# EAGLE design AetherMesh Test Fixture Mezz V1.0 (EAGLE 9.0.0)
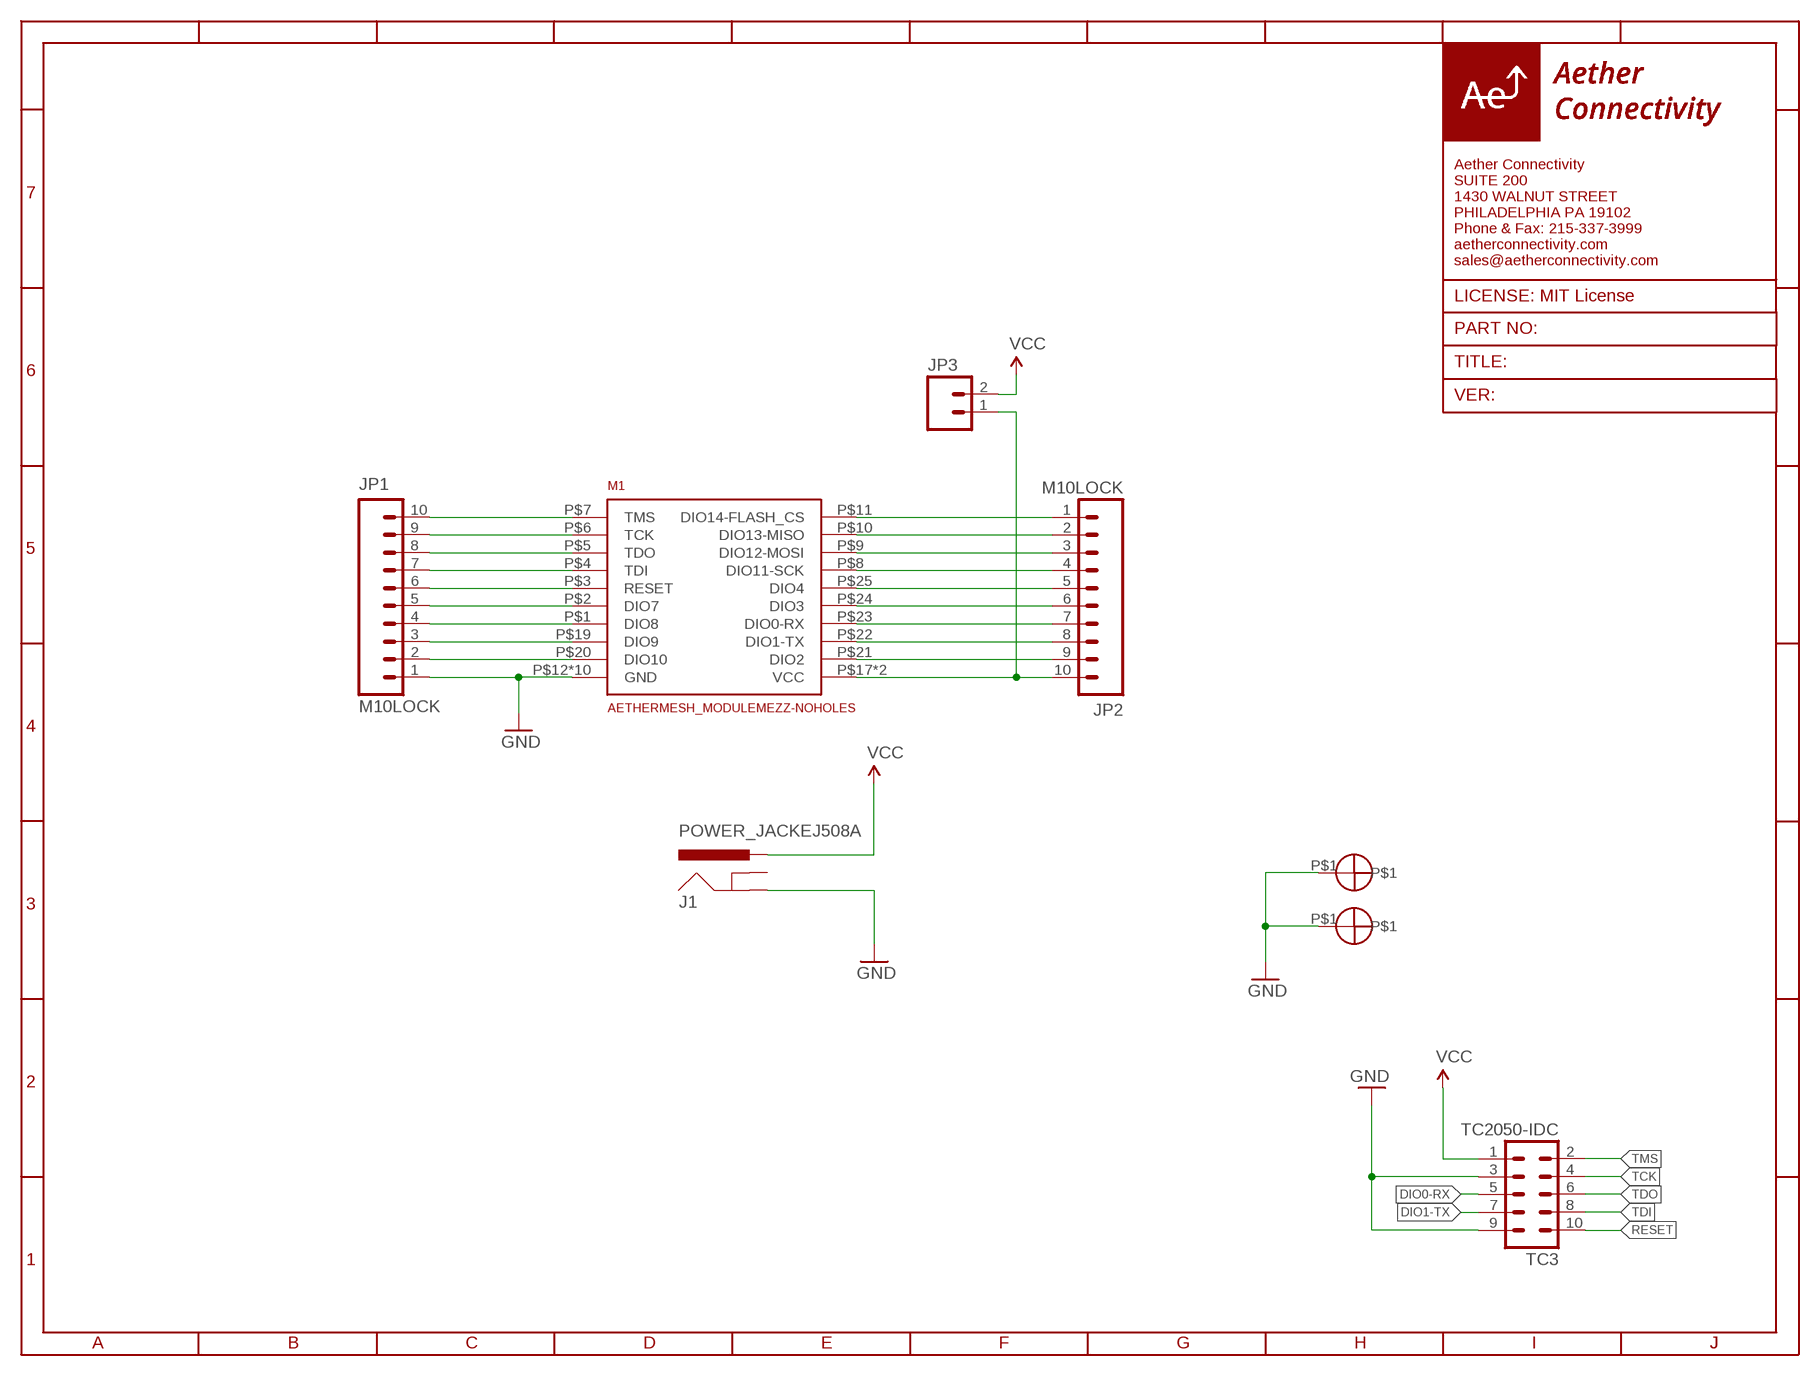
[diagram p0: schematic, sheet 1]

## Parts
J1  POWER_JACKEJ508A  [DC_JACK_EJ508A]
JP1  M10LOCK  [1X10_LOCK]
JP2  M10LOCK  [1X10_LOCK]
JP3  M02LOCK  [1X02_LOCK]
M1  AETHERMESH_MODULEMEZZ-NOHOLES  [AETHERMESH_MEZZ_MOUNT_NOHOLES]
S1  STANDOFFWURTH  [STANDOFF_WURTH_9774040243R]
S2  STANDOFFWURTH  [STANDOFF_WURTH_9774040243R]
TC3  TC2050-IDC  [TC2050-IDC]

## Nets
BUTTON: JP1.2 M1.P$20(DIO10)
CS: JP1.5 M1.P$2(DIO7)
DIO0-RX: JP2.7 M1.P$23(DIO0-RX) TC3.5
DIO1-TX: JP2.8 M1.P$22(DIO1-TX) TC3.7
DIO2: JP2.9 M1.P$21(DIO2)
DIO3: JP2.6 M1.P$24(DIO3)
DIO4: JP2.5 M1.P$25(DIO4)
ENC_RESET: JP1.4 M1.P$1(DIO8)
GND: J1.1(GND) JP1.1 M1.P$12(GND) M1.P$13(GND) M1.P$14(GND) M1.P$15(GND) M1.P$16(GND) M1.P$26(GND) M1.P$27(GND) M1.P$28(GND) M1.P$29(GND) M1.P$30(GND) S1.P$1 S2.P$1 TC3.3 TC3.9
INT: JP1.3 M1.P$19(DIO9)
MISO: JP2.2 M1.P$10(DIO13-MISO)
MOSI: JP2.3 M1.P$9(DIO12-MOSI)
N$1: JP2.1 M1.P$11(DIO14-FLASH_CS)
N$3: JP2.10 JP3.1 M1.P$17(VCC) M1.P$18(VCC)
RESET: JP1.6 M1.P$3(RESET) TC3.10
SCK: JP2.4 M1.P$8(DIO11-SCK)
TCK: JP1.9 M1.P$6(TCK) TC3.4
TDI: JP1.7 M1.P$4(TDI) TC3.8
TDO: JP1.8 M1.P$5(TDO) TC3.6
TMS: JP1.10 M1.P$7(TMS) TC3.2
VCC: J1.3(PWR) JP3.2 TC3.1
Unconnected: J1.2(GNDBREAK)

## Library data of the parts
J1 = 3. growflux:POWER_JACK: Power Jack This is the standard 5.5mm barrel jack for power. The PTH is the most common, proven, reliable, footprint. The Slot footprint only works if the mill layer is transmitted to the PCB fab house so be warned. Mating wall wart : TOL-00298 (and others)
JP1 JP2 = 3. growflux:M10: Header 10 Standard 10-pin 0.1" header. Use with straight break away headers (SKU : PRT-00116), right angle break away headers (PRT-00553), swiss pins (PRT-00743), machine pins (PRT-00117), and female headers (PRT-00115).
JP3 = 1. growflux:M02: Header 2 Standard 2-pin 0.1" header. Use with straight break away headers (SKU : PRT-00116), right angle break away headers (PRT-00553), swiss pins (PRT-00743), machine pins (PRT-00117), and female headers (PRT-00115). Molex polarized connector foot print use with SKU : PRT-08233 with associated crimp pins and housings.
M1 = AetherConnectivity:AETHERMESH_MODULE
S1 S2 = AetherConnectivity:STANDOFF; MFG#: 9774040243R
TC3 = TagConnect:TC2050-IDC: Tag-Connect In Circuit Programming & Debug Cable 10 Pin http://www.tag-connect.com

## Board
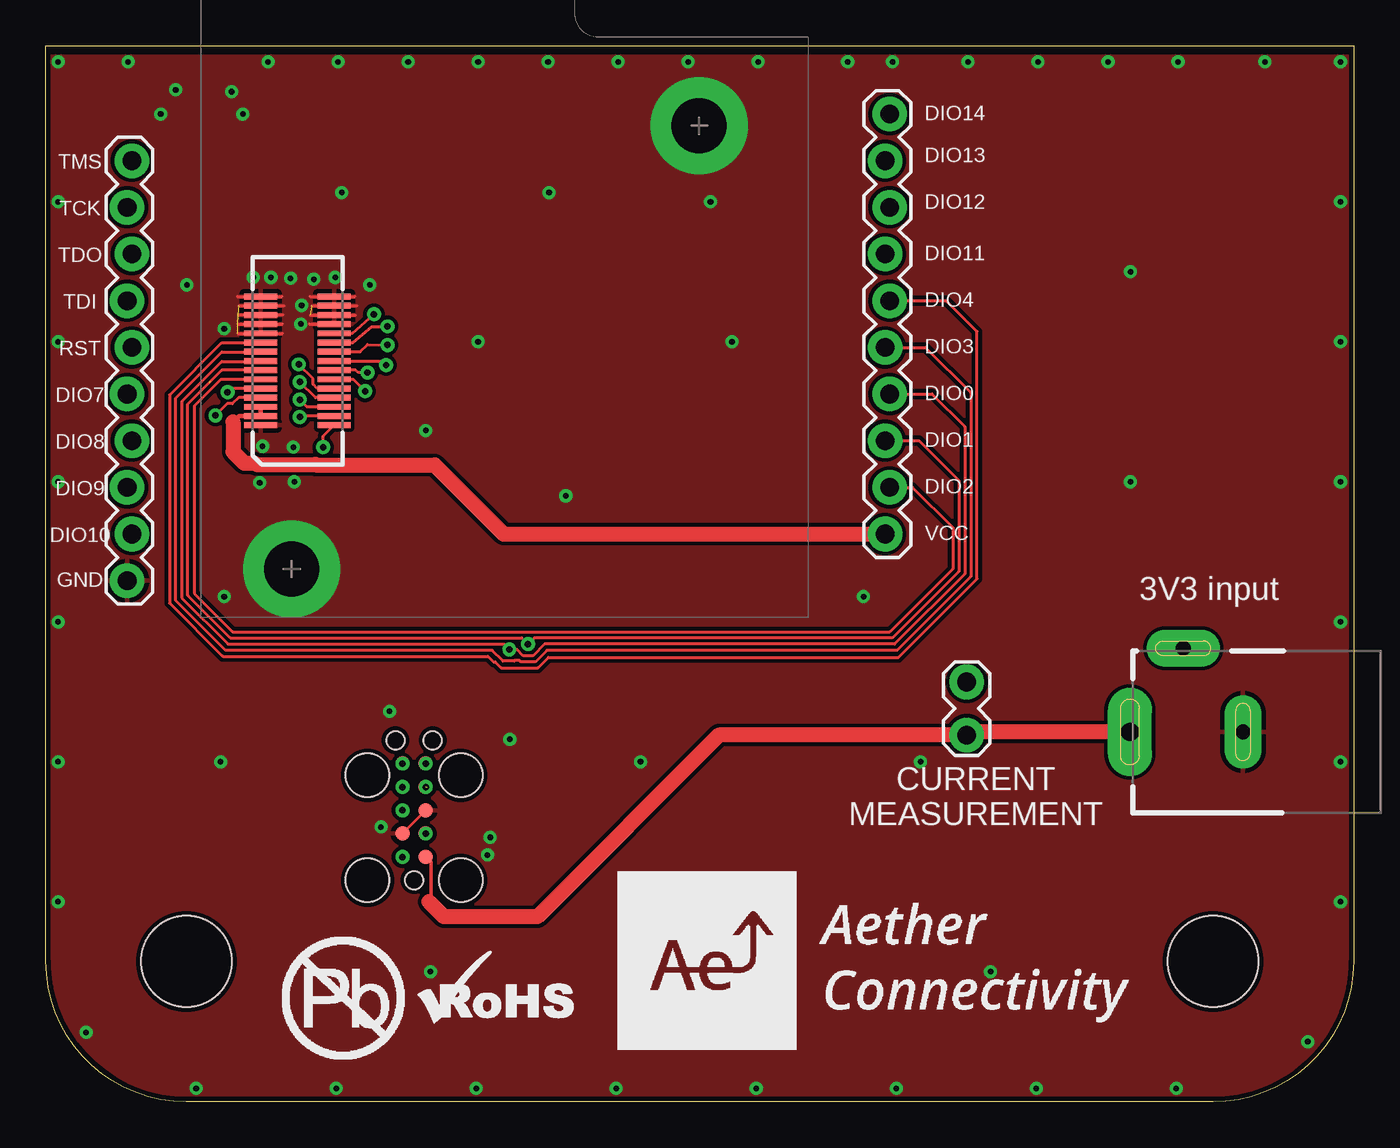
[diagram p1: board, top side]
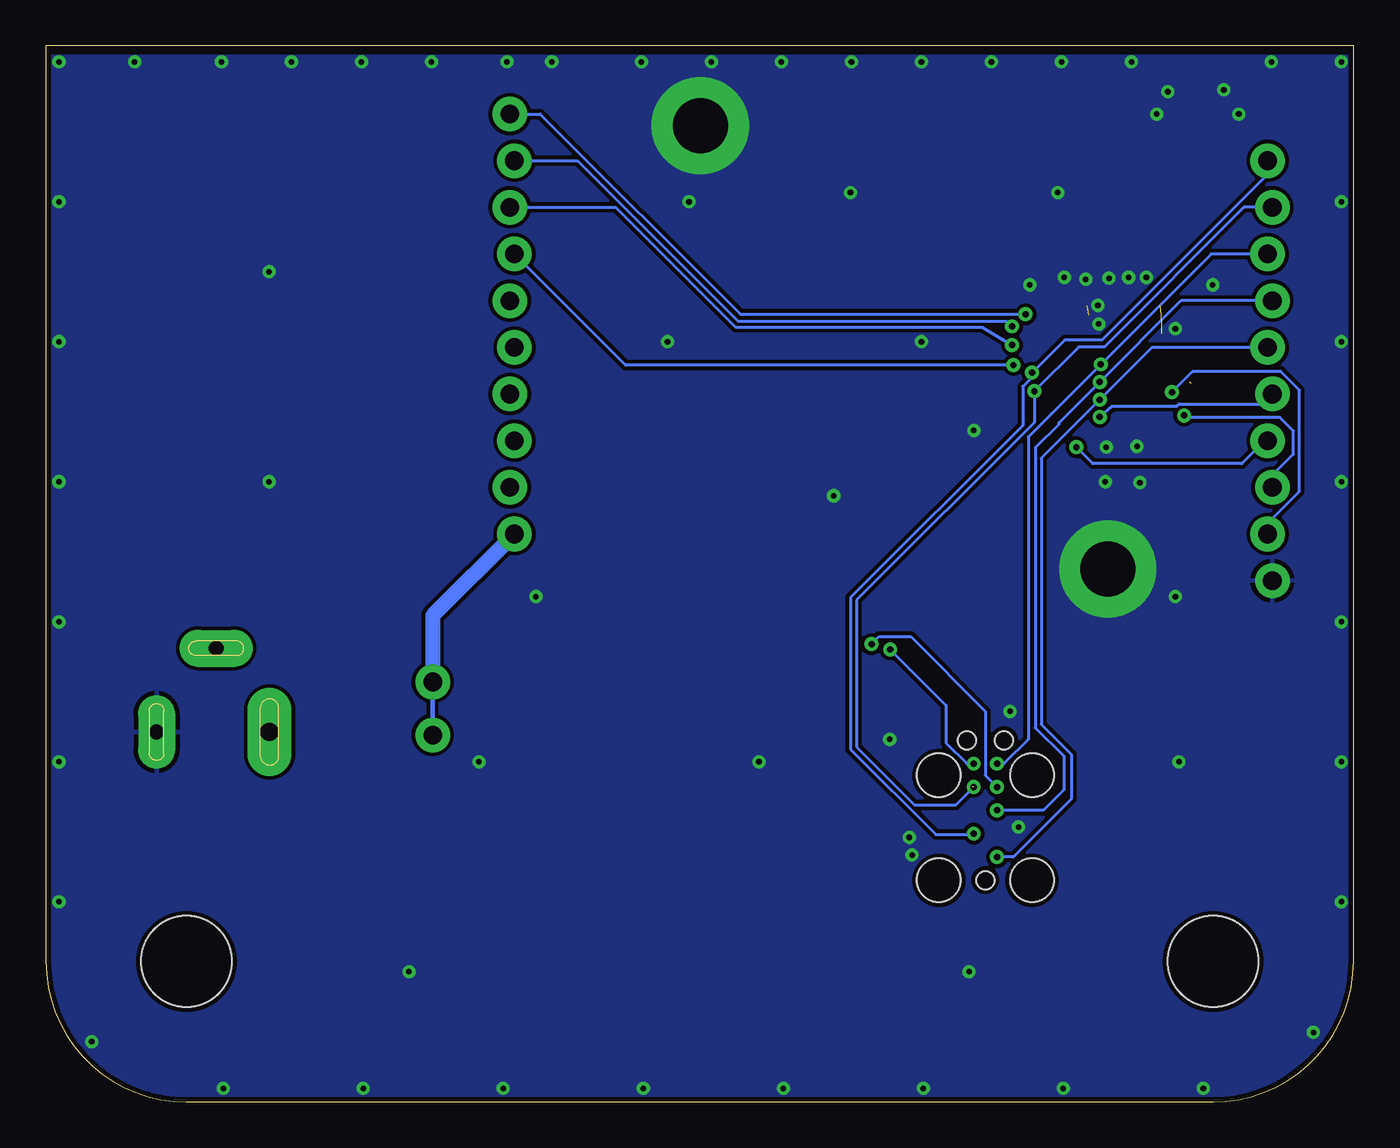
[diagram p2: board, bottom side, seen from below]

Size 71.17 x 57.48 mm. Coordinates in mm from the lower left corner, seen from the top.
Outline: 71.17,7.65 arc-90 63.53,0 7.65,0 arc-90 0,7.65 0,57.48 71.17,57.48 71.17,7.65
Copper layers (1*16): Top 0.035mm / dielectric 1.5mm / Bottom 0.035mm
Design rules "default *": minimum track width 6mil, minimum drill 12mil, track to track 7mil, track to pad 7mil, pad to pad 7mil, via to via 7mil, smd to smd 7mil, copper to edge 10mil, drill to drill 8mil, minimum pad ring 10mil, minimum via ring 8mil, stop-mask expansion 4mil, vias tented up to drill 20mil, thermal gap 10mil
Holes 4.95 mm at 7.65,7.65 63.53,7.65
vRestrict: area 59.4,3.5 to 67.7,11.8; area 3.5,3.5 to 11.8,11.8

### Footprints (pad centres in the part's own frame; a part is rotated, then mirrored left to right if it is on the bottom)
DC_JACK_EJ508A = drill 0.8 pad 2 long: 1 0,0; 2 4.55,3.25 | drill 1 pad 2.4 long: 3 0,6.15
1X10_LOCK = drill 1.016 pad 1.88: 1 0,0.127; 2 2.54,-0.127; 3 5.08,0.127; 4 7.62,-0.127; 5 10.16,0.127; 6 12.7,-0.127; 7 15.24,0.127; 8 17.78,-0.127; 9 20.32,0.127; 10 22.86,-0.127
1X02_LOCK = drill 1.016 pad 1.88: 1 -0.178,0; 2 2.718,0
AETHERMESH_MEZZ_MOUNT_NOHOLES = smd 1.8 x 0.32: P$1 2,-3.5; P$2 2,-3; P$3 2,-2.5; P$4 2,-2; P$5 2,-1.5; P$6 2,-1; P$7 2,-0.5; P$8 2,0; P$9 2,0.5; P$10 2,1; P$11 2,1.5; P$12 2,2; P$13 2,2.5; P$14 2,3; P$15 2,3.5; P$16 -2,-3.5; P$17 -2,-3; P$18 -2,-2.5; P$19 -2,-2; P$20 -2,-1.5; P$21 -2,-1; P$22 -2,-0.5; P$23 -2,0; P$24 -2,0.5; P$25 -2,1; P$26 -2,1.5; P$27 -2,2; P$28 -2,2.5; P$29 -2,3; P$30 -2,3.5
STANDOFF_WURTH_9774040243R = drill 3 pad 5.3: P$1 0,0
TC2050-IDC = smd 0.787 x 0.787: 1 -2.54,-0.635; 2 -1.27,-0.635; 3 0,-0.635; 4 1.27,-0.635; 5 2.54,-0.635; 6 2.54,0.635; 7 1.27,0.635; 8 0,0.635; 9 -1.27,0.635; 10 -2.54,0.635 | hole 0.991: -3.81,0; 3.81,1.016; 3.81,-1.016 | hole 2.375: -3.81,2.54; -3.81,-2.54; 1.905,2.54; 1.905,-2.54

### Placement (x,y rotation side)
J1  65.15,20.14 90 top
JP1  4.55,28.37 90 top
JP2  45.8,53.77 270 top
JP3  50.11,22.68 270 top
M1  13.69,40.34 0 top
S1  35.55,53.14 0 top
S2  13.37,29.01 0 top
TC3  20.04,15.88 90 top

### Tracks (layer width: path | path; a pad name or v marks a point on that pad's centre or on a via)
BUTTON  (via drill 0.35)
  Top 0.152: M1.P$20 10.08,38.84 v9.88,38.63
  Bottom 0.152: JP1.2 4.67,31.51 2.95,33.24 2.95,38.75 3.94,39.74 3.94,39.75 8.76,39.75 v9.88,38.63
CS  (via drill 0.35)
  Top 0.152: M1.P$2 13.87,37.34 v13.82,37.29
  Bottom 0.152: v13.82,37.29 13.13,37.87 9.61,37.87 9.48,38 4.96,38 JP1.5
DIO0-RX  (via drill 0.35)
  Top 0.152: JP2.7 48.23,38.53 50.01,36.75 50.01,28.75 46.18,24.92 27.13,24.92 26.5,24.29 25.98,24.29 25.63,24.63 v25.22,24.63 24.93,24.92 9.92,24.92 7.39,27.44 7.39,38.13 9.58,40.31 11.67,40.31 M1.P$23
  Bottom 0.152: v25.22,24.63 22.17,21.58 22.17,19.53 21.06,18.42 TC3.5
  other vias: 20.68,18.42
DIO1-TX  (via drill 0.35)  (1 unrouted)
  Top 0.152: JP2.8 47.52,35.99 49.68,33.83 49.68,28.88 46.06,25.26 26.58,25.26 v26.24,24.92 25.89,25.26 10.04,25.26 7.72,27.58 7.72,37.99 8.95,39.21 | M1.P$22 9.57,39.84 8.87,39.14
  Bottom 0.152: v26.24,24.92 25.83,25.32 24.1,25.32 20.04,21.26 20.04,17.78 TC3.7
  other vias: 19.41,17.15
DIO2
  Top 0.152: JP2.9 47.17,33.45 49.35,31.27 49.35,29.02 45.92,25.59 10.17,25.59 8.08,27.69 8.08,37.88 9.53,39.34 M1.P$21 | M1.P$21
DIO3
  Top 0.152: JP2.6 47.88,41.07 50.34,38.61 50.34,28.61 46.32,24.59 27.27,24.59 26.64,23.96 25.84,23.96 25.76,24.03 25.52,24.03 25.48,24 24.87,24 24.28,24.59 9.78,24.59 7.06,27.31 7.06,38.3 9.58,40.82 11.67,40.82 M1.P$24
DIO4
  Top 0.152: M1.P$25 11.68,41.33 9.58,41.33 6.73,38.48 6.73,27.15 9.6,24.28 | JP2.5 49,43.61 50.67,41.94 50.67,28.47 46.41,24.21 27.36,24.21 26.77,23.63 24.78,23.63 24.45,23.95 24.36,23.95 24.05,24.26 9.64,24.26 9.62,24.28 9.6,24.28 | 9.6,24.28 9.63,24.26
ENC_RESET  (via drill 0.35)
  Top 0.152: v15.09,35.64 15.09,36.23 M1.P$1
  Bottom 0.152: JP1.4 4.83,35.99 6.07,34.75 14.2,34.75 v15.09,35.64
GND  (via drill 0.3)  (4 unrouted)
  Top 0.152: 10.41,43.84 12.85,43.84 | 10.52,43.33 12.95,43.33 | 10.46,42.85 12.9,42.85 | 10.44,42.34 12.88,42.34 | 10.44,41.83 12.88,41.83 | 14.38,43.84 16.81,43.84 | 14.48,43.33 16.92,43.33 | 14.4,42.82 16.84,42.82 | 14.33,42.34 16.48,42.34 | TC3.3 TC3.9
  other vias: 43.64,56.62 46.08,56.62 6.25,53.77 7.06,55.09 10.72,53.77 10.11,54.99 0.66,56.62 0.66,49 0.66,41.38 0.66,33.76 0.66,10.9 8.18,0.74 15.9,56.62 23.52,56.62 31.14,56.62 38.76,56.62 54,56.62 61.62,56.62 70.46,56.62 19.71,56.62 27.33,56.62 34.95,56.62 50.19,56.62 57.81,56.62 66.34,56.62 4.47,56.62 12.09,56.62 15.8,0.74 23.42,0.74 38.66,0.74 61.52,0.74 70.46,41.38 70.46,33.76 70.46,26.14 70.46,10.9 16.1,49.5 27.38,49.5 23.52,41.38 28.3,32.99 37.34,41.38 20.68,36.55 18.69,21.26 24.03,13.44 24.18,14.4 0.66,26.14 0.66,18.52 31.04,0.74 46.28,0.74 53.9,0.74 70.46,18.52 70.46,49 59.03,45.19 59.03,33.76 47.6,18.52 32.36,18.52 9.5,18.52 51.41,7.09 20.93,7.09 36.17,49 2.18,3.78 68.68,3.28 9.7,27.51 44.5,27.51 11.28,44.88 12.24,44.88 13.31,44.83 14.58,44.78 15.75,44.88 17.63,44.48 13.92,43.36 13.87,42.34 9.7,42.09 7.67,44.48 11.79,35.69 13.46,35.64 11.63,33.71 13.51,33.76 25.25,19.74 18.24,14.96
  pour Bottom (isolate 0.203, rank 2): 0.28,56.92 0.28,7.9 arc90 7.9,0.28 63.53,0.28 arc90 70.89,7.65 70.89,56.92
  pour Top (isolate 0.203, rank 2): 0.28,56.92 0.28,7.9 arc90 7.9,0.28 63.53,0.28 arc90 70.89,7.65 70.89,56.92
INT  (via drill 0.35)
  Top 0.152: v9.22,37.36 9.86,38 10.14,38 10.48,38.34 M1.P$19
  Bottom 0.152: JP1.3 4.42,34.11 3.28,35.26 3.28,36.53 4.01,37.26 9.02,37.26 v9.22,37.36
MISO  (via drill 0.35)
  Top 0.152: M1.P$10 16.72,41.34 17.75,42.19 18.57,42.19 v18.59,42.22
  Bottom 0.152: JP2.2 42.24,51.23 33.5,42.49 18.87,42.49 v18.59,42.22
MOSI  (via drill 0.35)
  Top 0.152: M1.P$9 17.11,40.84 17.5,41.22 v18.59,41.2
  Bottom 0.152: JP2.3 40.17,48.69 33.64,42.16 20.22,42.16 v18.59,41.2
N$1  (via drill 0.35)
  Top 0.152: M1.P$11 16.69,41.86 v17.86,42.88
  Bottom 0.152: JP2.1 44.27,53.77 33.38,42.88 v17.86,42.88
N$3
  Top 0.254: M1.P$18 M1.P$17 10.51,37.34 10.19,37.01
  Top 0.813: 10.19,37.01 10.19,35.38 10.79,34.77 11.37,34.77 11.45,34.7 14.67,34.7 14.69,34.67 21.16,34.67 24.92,30.91 JP2.10
  Bottom 0.813: JP2.10 50.11,26.47 JP3.1
RESET  (via drill 0.35)
  Top 0.152: M1.P$3 14.2,37.84 v13.82,38.22
  Bottom 0.152: JP1.6 10.97,41.07 v13.82,38.22 16.99,35.05 16.99,20.55 15.37,18.92 15.37,16.48 18.52,13.34 TC3.10
  other vias: 19.41,13.33
SCK  (via drill 0.35)
  Top 0.152: M1.P$8 18.29,40.34 v18.52,40.11
  Bottom 0.152: v18.52,40.11 39.62,40.11 JP2.4
TCK  (via drill 0.35)  (1 unrouted)
  Top 0.152: M1.P$6 16.72,39.34 v17.37,38.68 | 20.75,17.04 20.75,17.15
  Bottom 0.152: JP1.9 5.97,48.69 13.56,41.1 14.96,41.1 v17.37,38.68 17.37,36.99 27.05,27.32 27.05,19.33 23.9,16.18 21.64,16.18 TC3.4
  other vias: 20.68,17.15
TDI  (via drill 0.35)
  Top 0.152: M1.P$4 14.67,38.34 v13.82,39.19
  Bottom 0.152: JP1.7 9.4,43.61 v13.82,39.19 16.05,36.96 16.05,36.88 17.32,35.61 17.32,20.37 15.77,18.82 15.77,16.99 16.89,15.88 TC3.8
  other vias: 19.41,15.88
TDO  (via drill 0.35)
  Top 0.152: v13.76,40.15 14.54,39.37 14.54,39.07 14.77,38.84 M1.P$5
  Bottom 0.152: JP1.8 7.75,46.15 v13.76,40.15 16.43,37.47 17.7,36.2 17.7,19.74 19.02,18.42 TC3.6
  other vias: 19.41,18.42
TMS  (via drill 0.35)
  Top 0.152: v17.5,39.7 16.99,39.7 16.87,39.83 15.7,39.83 M1.P$7
  Bottom 0.152: JP1.10 4.67,50.5 13.69,41.48 15.72,41.48 v17.49,39.71 | v17.49,39.71 v17.5,39.7 | v17.49,39.71 17.49,39.46 18.01,38.95 18.01,36.83 27.38,27.45 27.38,19.19 22.74,14.55 20.73,14.55 TC3.2
  other vias: 20.68,14.61
VCC
  Top 0.203: TC3.1 20.95,13.06 20.95,11 20.85,10.9
  Top 0.813: J1.3 50.29,20.14 JP3.2 36.63,19.96 26.75,10.08 21.67,10.08 20.85,10.9
  Bottom 0.254: JP3.2 50.11,22.89

### Text on the board
tPlace: DIO14 | DIO13 | TMS | DIO12 | TCK | TDO | DIO11 | DIO4 | TDI | RST | DIO3 | DIO0 | DIO7 | DIO8 | DIO1 | DIO2 | DIO9 | DIO10 | VCC | GND | 3V3 input | CURRENT / MEASUREMENT